# EAGLE design lcd_buckler_mk_2 (EAGLE 6.5.0)
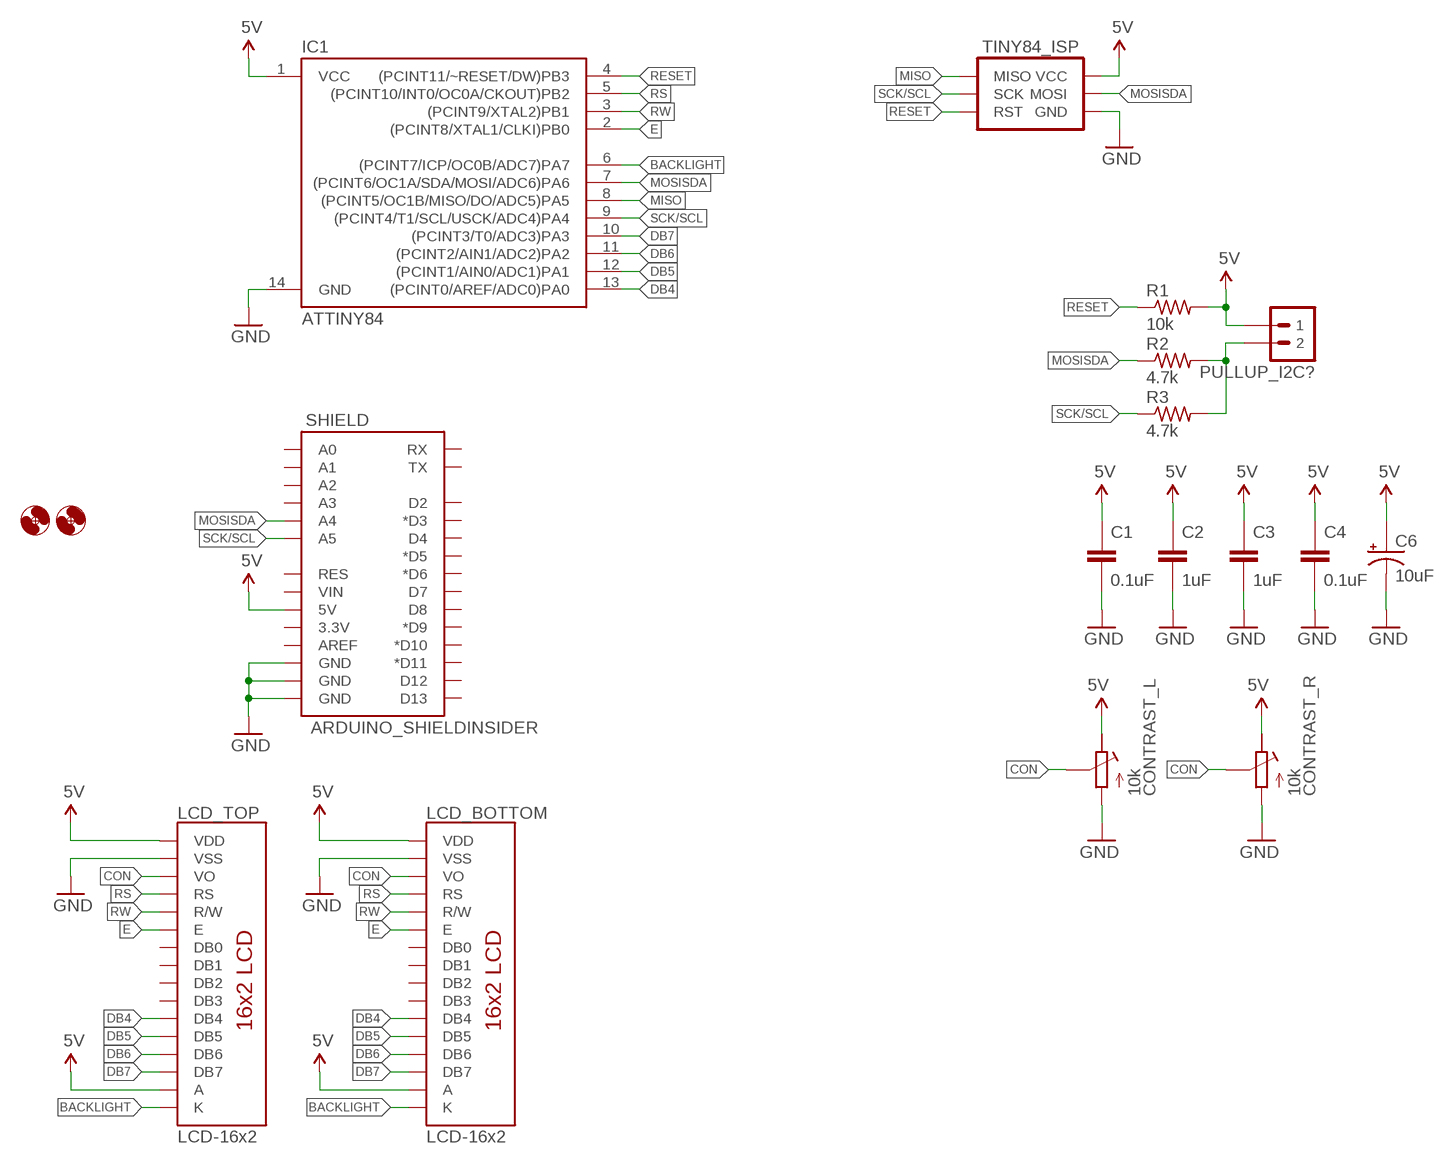
[diagram p0: schematic, sheet 1]

## Parts
C1  0.1uF  CAPACITOR-CERAMICC0805  [C0805]
C2  1uF  CAPACITOR-CERAMIC025-024X044  [C025-024X044]
C3  1uF  CAPACITOR-CERAMIC025-024X044  [C025-024X044]
C4  0.1uF  CAPACITOR-CERAMIC025-024X044  [C025-024X044]
C6  10uF  CAPACITOR-POLARIZEDE2.5-5  [E2,5-5]
CONTRAST_L  10k  POTENTIOMETERTHUMBWHEEL-16MM  [POT-THUMBWHEEL]
CONTRAST_R  10k  POTENTIOMETERTHUMBWHEEL-16MM  [POT-THUMBWHEEL]
H1  HOLE#2  [HOLE-#2]
H2  HOLE#2  [HOLE-#2]
IC1  ATTINY84  [SO14]
LCD_BOTTOM  LCD-16x2  LCD-16X2HOLESONLY  [LCD-16X2-PINS-ONLY]
LCD_TOP  LCD-16x2  LCD-16X2HOLESONLY  [LCD-16X2-PINS-ONLY]
PULLUP_I2C?  M02PTH  [1X02]
R1  10k  RESISTORR0805  [R0805]
R2  4.7k  RESISTORPTH-AXIAL-7.68MM  [RESISTOR-AXIAL-PTH-7.68MM]
R3  4.7k  RESISTORPTH-AXIAL-7.68MM  [RESISTOR-AXIAL-PTH-7.68MM]
SHIELD  ARDUINO_SHIELDINSIDER  [ARDUINO_SHIELD_NOOUTLINE_INSIDE]
TINY84_ISP  AVR_SPI_PRG_6PTH  [2X3]

## Nets
5V: C1.1 C2.1 C3.1 C4.1 C6.+ CONTRAST_L.3(E) CONTRAST_R.3(E) IC1.1(VCC) LCD_BOTTOM.2(VDD) LCD_BOTTOM.15(A) LCD_TOP.2(VDD) LCD_TOP.15(A) PULLUP_I2C?.1 R1.2 SHIELD.5V TINY84_ISP.2(VCC)
BACKLIGHT: IC1.6((PCINT7/ICP/OC0B/ADC7)PA7) LCD_BOTTOM.16(K) LCD_TOP.16(K)
CON: CONTRAST_L.2(S) CONTRAST_L.2@1(S) CONTRAST_R.2(S) CONTRAST_R.2@1(S) LCD_BOTTOM.3(VO) LCD_TOP.3(VO)
DB4: IC1.13((PCINT0/AREF/ADC0)PA0) LCD_BOTTOM.11(DB4) LCD_TOP.11(DB4)
DB5: IC1.12((PCINT1/AIN0/ADC1)PA1) LCD_BOTTOM.12(DB5) LCD_TOP.12(DB5)
DB6: IC1.11((PCINT2/AIN1/ADC2)PA2) LCD_BOTTOM.13(DB6) LCD_TOP.13(DB6)
DB7: IC1.10((PCINT3/T0/ADC3)PA3) LCD_BOTTOM.14(DB7) LCD_TOP.14(DB7)
E: IC1.2((PCINT8/XTAL1/CLKI)PB0) LCD_BOTTOM.6(E) LCD_TOP.6(E)
GND: C1.2 C2.2 C3.2 C4.2 C6.- CONTRAST_L.1(A) CONTRAST_R.1(A) IC1.14(GND) LCD_BOTTOM.1(VSS) LCD_TOP.1(VSS) SHIELD.GND@0(GND) SHIELD.GND@1(GND) SHIELD.GND@2(GND) TINY84_ISP.6(GND)
MISO: IC1.8((PCINT5/OC1B/MISO/DO/ADC5)PA5) TINY84_ISP.1(MISO)
MOSISDA: IC1.7((PCINT6/OC1A/SDA/MOSI/ADC6)PA6) R2.P$1 SHIELD.A4 TINY84_ISP.4(MOSI)
N$1: PULLUP_I2C?.2 R2.P$2 R3.P$2
RESET: IC1.4((PCINT11/~RESET/DW)PB3) R1.1 TINY84_ISP.5(RST)
RS: IC1.5((PCINT10/INT0/OC0A/CKOUT)PB2) LCD_BOTTOM.4(RS) LCD_TOP.4(RS)
RW: IC1.3((PCINT9/XTAL2)PB1) LCD_BOTTOM.5(R/W) LCD_TOP.5(R/W)
SCK/SCL: IC1.9((PCINT4/T1/SCL/USCK/ADC4)PA4) R3.P$1 SHIELD.A5 TINY84_ISP.3(SCK)
Unconnected: LCD_BOTTOM.7(DB0) LCD_BOTTOM.8(DB1) LCD_BOTTOM.9(DB2) LCD_BOTTOM.10(DB3) LCD_TOP.7(DB0) LCD_TOP.8(DB1) LCD_TOP.9(DB2) LCD_TOP.10(DB3) SHIELD.3.3V SHIELD.A0 SHIELD.A1 SHIELD.A2 SHIELD.A3 SHIELD.AREF SHIELD.D2 SHIELD.D3(*D3) SHIELD.D4 SHIELD.D5(*D5) SHIELD.D6(*D6) SHIELD.D7 SHIELD.D8 SHIELD.D9(*D9) SHIELD.D10(*D10) SHIELD.D11(*D11) SHIELD.D12 SHIELD.D13 SHIELD.RES SHIELD.RX SHIELD.TX SHIELD.VIN

## Library data of the parts
C1-C4 = A_butts:CAPACITOR-CERAMIC: CAPACITOR, European symbol
C6 = A_butts:CAPACITOR-POLARIZED: POLARIZED CAPACITOR, American symbol
CONTRAST_L CONTRAST_R = A_butts:POTENTIOMETER: Trimm resistor
H1 H2 = A_butts:HOLE: MOUNTING HOLE with drill center marker
IC1 = A_butts:ATTINY84: Atmel 14-pin 2/4/8kB flash uC
LCD_BOTTOM LCD_TOP = A_butts:LCD-16X2: Standard text-only 16x2 parallel input LCD
PULLUP_I2C? = A_butts:M02: Standard 2-pin 0.1" header. Use with - straight break away headers ( PRT-00116) - right angle break away headers (PRT-00553) - swiss pins (PRT-00743) - machine pins (PRT-00117) - female headers (PRT-00115) Molex polarized connector foot print use with: PRT-08233 with associated crimp pins and housings. 2.54_SCREWTERM for use with PRT-10571. 3.5mm Screw Terminal footprints for PRT-08084 5mm Screw Terminal footprints for use with PRT-08433
R1-R3 = A_butts:RESISTOR: RESISTOR, American symbol
SHIELD = A_butts:ARDUINO_SHIELD: Arduino shield footprint
TINY84_ISP = A_butts:AVR_SPI_PRG_6: AVR ISP 6 Pin This is the reduced ISP connector for AVR programming. Common on Arduino. This footprint will take up less PCB space and can be used with a 10-pin to 6-pin adapter such as SKU: BOB-08508 **Special note about "TEST_POINT" package. The stop mask is on the top side, so if you want your programming test points to be on the bottom of your board, make sure to place this package on the bottom side of the board. This also ensure that the orientation to program from the bottom side will be correct.

## Board
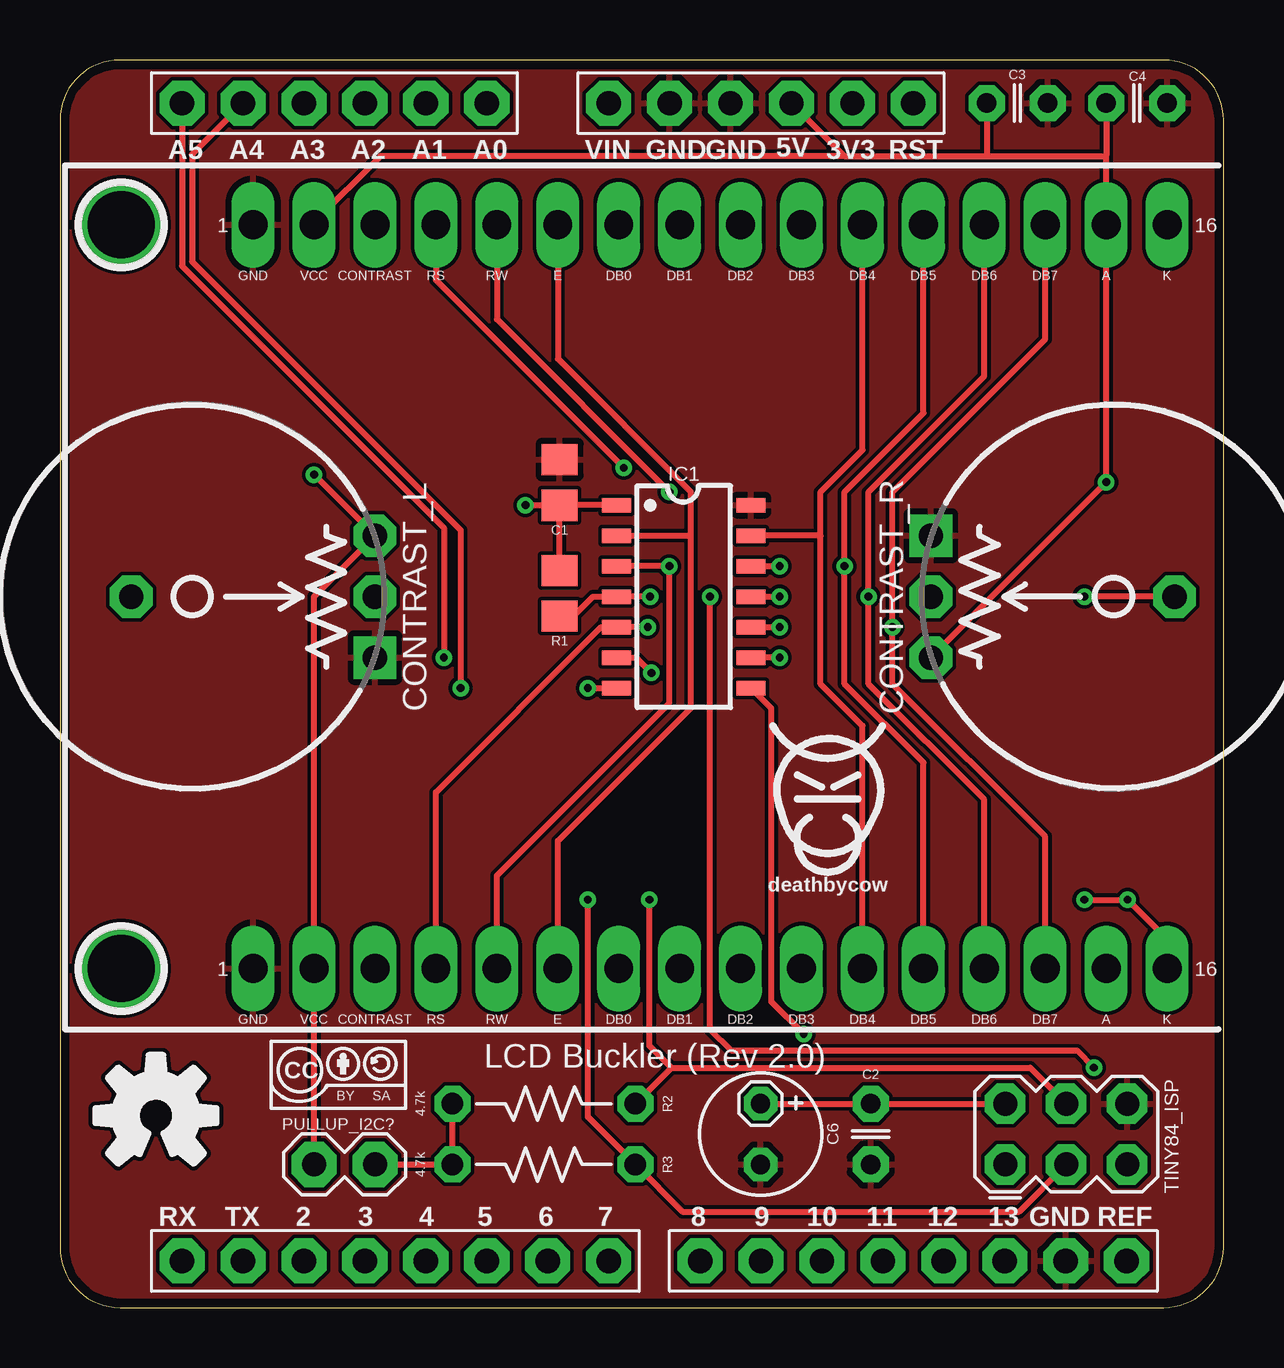
[diagram p1: board, top side]
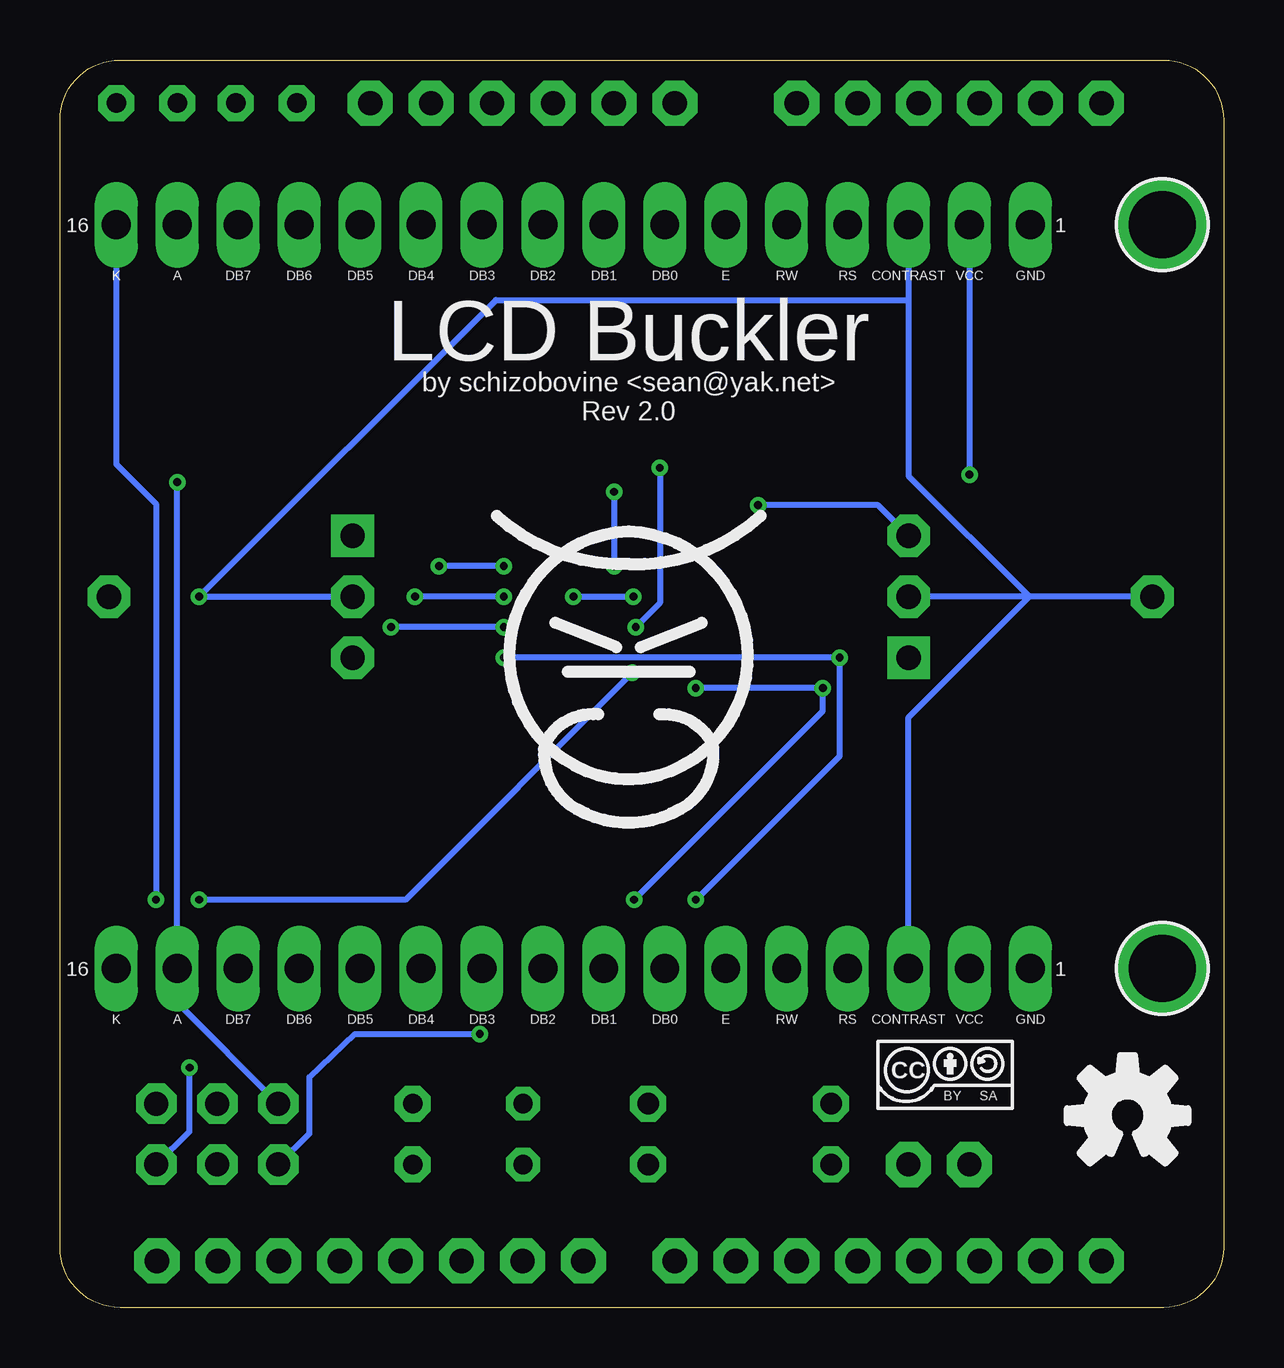
[diagram p2: board, bottom side, seen from below]

Size 48.5 x 52 mm. Coordinates in mm from the lower left corner, seen from the top.
Outline: 48.5,2.5 48.5,49.5 arc90 46,52 2.5,52 arc90 0,49.5 0,2.5 arc90 2.5,0 46,0 arc90 48.5,2.5
Copper layers (1*16): Top 0.0356mm / dielectric 1.5011mm / Bottom 0.0356mm
Design rules "LaenPCBOrder_2": minimum track width 6mil, minimum drill 13mil, track to track 6mil, track to pad 6mil, pad to pad 6mil, via to via 6mil, smd to smd 6mil, copper to edge 15mil, drill to drill 6mil, minimum pad ring 7mil, minimum via ring 7mil, stop-mask expansion 3mil, vias tented up to drill 20mil, thermal gap 10mil

### Footprints (pad centres in the part's own frame; a part is rotated, then mirrored left to right if it is on the bottom)
C0805 = smd 1.3 x 1.5: 1 -0.95,0; 2 0.95,0
C025-024X044 = drill 0.813 pad 1.5 octagon: 1 -1.27,0; 2 1.27,0
E2,5-5 = drill 0.8 pad 1.4 octagon: + -1.27,0; - 1.27,0
POT-THUMBWHEEL = drill 1.016 pad 1.778 square: 1 -2.54,0 | drill 1.016 pad 1.778 octagon: 2 0,0; 2@1 0,10.16; 3 2.54,0
HOLE-#2 = drill 2.8 pad 3.81: P$1 0,0
SO14 = smd 0.6 x 1.2: 1 -3.81,-2.8; 2 -2.54,-2.8; 3 -1.27,-2.8; 4 0,-2.8; 5 1.27,-2.8; 6 2.54,-2.8; 7 3.81,-2.8; 8 3.81,2.8; 9 2.54,2.8; 10 1.27,2.8; 11 0,2.8; 12 -1.27,2.8; 13 -2.54,2.8; 14 -3.81,2.8
LCD-16X2-PINS-ONLY = drill 1.2 pad 1.778 long: 1 0,0; 2 2.54,0; 3 5.08,0; 4 7.62,0; 5 10.16,0; 6 12.7,0; 7 15.24,0; 8 17.78,0; 9 20.32,0; 10 22.86,0; 11 25.4,0; 12 27.94,0; 13 30.48,0; 14 33.02,0; 15 35.56,0; 16 38.1,0
1X02 = drill 1 pad 1.88 octagon: 1 0,0; 2 2.54,0
R0805 = smd 1.3 x 1.5: 1 -0.95,0; 2 0.95,0
RESISTOR-AXIAL-PTH-7.68MM = drill 0.9 pad 1.5 octagon: P$1 -3.81,0; P$2 3.81,0
ARDUINO_SHIELD_NOOUTLINE_INSIDE = drill 1.016 pad 1.88 octagon: 3.3V 48.26,-27.94; 5V 48.26,-25.4; A0 48.26,-12.7; A1 48.26,-10.16; A2 48.26,-7.62; A3 48.26,-5.08; A4 48.26,-2.54; A5 48.26,0; AREF 0,-39.37; D2 0,-5.08; D3 0,-7.62; D4 0,-10.16; D5 0,-12.7; D6 0,-15.24; D7 0,-17.78; D8 0,-21.59; D9 0,-24.13; D10 0,-26.67; D11 0,-29.21; D12 0,-31.75; D13 0,-34.29; GND@0 48.26,-22.86; GND@1 48.26,-20.32; GND@2 0,-36.83; RES 48.26,-30.48; RX 0,0; TX 0,-2.54; VIN 48.26,-17.78
2X3 = drill 1 pad 1.676 octagon: 1 -2.54,-1.27; 2 -2.54,1.27; 3 0,-1.27; 4 0,1.27; 5 2.54,-1.27; 6 2.54,1.27

### Placement (x,y rotation side)
C1  20.83,34.39 90 top
C2  33.8,7.23 270 top
C3  39.9,50.2 0 top
C4  44.88,50.2 0 top
C6  29.2,7.23 270 top
CONTRAST_L  13.13,29.63 90 top
CONTRAST_R  36.3,29.63 270 top
H1  2.55,45.13 270 top
H2  2.55,14.13 270 top
IC1  26,29.63 270 top
LCD_BOTTOM  8.05,14.13 0 top
LCD_TOP  8.05,45.13 0 top
PULLUP_I2C?  10.59,5.96 0 top
R1  20.83,29.77 90 top
R2  20.17,8.5 180 top
R3  20.17,5.96 180 top
SHIELD  5.09,1.94 90 top
TINY84_ISP  41.94,7.23 0 top
U$1  [COW]  24.8,26 0 bottom
U$2  [COW_SMALL]  32,21.7 0 top
U$3  [CC-BY-SA-4.0-NO-URL]  11.6,9.7 0 top
U$4  [CC-BY-SA-4.0-NO-URL]  11.6,9.7 0 bottom
U$5  [OSHWLOGO_TOP_0.2_A]  4,8 0 top
U$6  [OSHWLOGO_BOT_0.2_A]  4,8 0 top

### Tracks (layer width: path | path; a pad name or v marks a point on that pad's centre or on a via)
5V  (via drill 0.33)
  Top 0.25: SHIELD.5V 32.69,48 | 32.69,48 38.63,48 | 38.63,48 43.6,48 | C3.1 38.63,48 | C4.1 43.61,48.01 43.6,48 | 43.6,48 43.61,47.99 LCD_TOP.15 v43.61,34.4 CONTRAST_R.3 | 32.69,48 13.36,48 10.59,45.23 LCD_TOP.2 | v10.59,34.71 CONTRAST_L.3 10.59,29.63 LCD_BOTTOM.2 PULLUP_I2C?.1 | C6.+ C2.1 TINY84_ISP.2 | IC1.1 C1.1 | R1.2 C1.1 | v19.4,33.44 C1.1
  Bottom 0.25: LCD_TOP.2 v10.59,34.71 | TINY84_ISP.2 43.61,12.71 LCD_BOTTOM.15 v43.61,34.4 | CONTRAST_L.3 14.4,33.44 v19.4,33.44
BACKLIGHT  (via drill 0.33)
  Top 0.25: IC1.6 24.01,27.09 v24.65,26.45 | v42.7,17 v44.5,17 46.15,15.35 LCD_BOTTOM.16
  Bottom 0.25: v24.65,26.45 34.1,17 v42.7,17 | LCD_TOP.16 46.15,35.15 44.5,33.5 v44.5,17
CON  (via drill 0.33)
  Top 0.25: CONTRAST_R.2@1 v42.7,29.63
  Bottom 0.25: CONTRAST_L.2@1 8.1,29.63 | 8.1,29.63 CONTRAST_L.2 | CONTRAST_R.2 v42.7,29.63 30.33,42 13.13,42 | LCD_BOTTOM.3 13.13,24.6 8.1,29.63 | LCD_TOP.3 13.13,42 | 13.13,42 13.13,34.66 8.1,29.63
DB4
  Top 0.25: LCD_BOTTOM.11 33.45,24.25 31.7,26 31.7,32.17 | LCD_TOP.11 33.45,35.75 31.7,34 31.7,32.17 | 31.7,32.17 IC1.13
DB5  (via drill 0.33)
  Top 0.25: LCD_BOTTOM.12 35.99,22.71 32.7,26 v32.7,30.9 32.7,34 35.99,37.29 LCD_TOP.12 | IC1.12 v30,30.9
  Bottom 0.25: v30,30.9 v32.7,30.9
DB6  (via drill 0.33)
  Top 0.25: LCD_BOTTOM.13 38.53,21.17 33.7,26 v33.7,29.63 33.7,34 38.53,38.83 LCD_TOP.13 | IC1.11 v30,29.63
  Bottom 0.25: v30,29.63 v33.7,29.63
DB7  (via drill 0.33)
  Top 0.25: LCD_BOTTOM.14 41.07,19.63 34.7,26 v34.7,28.36 34.7,34 41.07,40.37 LCD_TOP.14 | IC1.10 v30,28.36
  Bottom 0.25: v30,28.36 v34.7,28.36
E
  Top 0.25: LCD_TOP.6 20.75,39.55 26.3,34 26.3,32.2 | LCD_BOTTOM.6 20.75,19.45 26.3,25 26.3,32.2 | IC1.2 26.27,32.17 26.3,32.2
GND
  pour Top: 2.5,52 46,52 arc-90 48.5,49.5 48.5,2.5 arc-90 46,0 2.5,0 arc-90 0,2.5 0,49.5 arc-90
MISO  (via drill 0.33)
  Top 0.25: v31,11.4 29.65,12.75 29.65,24.97 IC1.8
  Bottom 0.25: TINY84_ISP.1 38.1,7.26 38.1,9.6 36.2,11.4 v31,11.4
MOSISDA  (via drill 0.33)
  Top 0.25: SHIELD.A4 5.5,48.07 5.5,43.6 16.7,32.4 v16.7,25.82 | R2.P$1 25.48,10 | 25.48,10 40.44,10 TINY84_ISP.4 | v22,25.82 IC1.7 | 25.48,10 24.57,10.91 v24.57,17
  Bottom 0.25: v22,25.82 v16.7,25.82 16.7,24.87 v24.57,17
N$1
  Top 0.25: PULLUP_I2C?.2 R3.P$2 R2.P$2
RESET  (via drill 0.33)
  Top 0.25: R1.1 21.4,28.82 22.21,29.63 IC1.4 v24.6,29.63 | v43.1,10 42.4,10.7 28,10.7 27.1,11.6 v27.1,29.63
  Bottom 0.25: TINY84_ISP.5 43.1,7.34 v43.1,10 | v27.1,29.63 v24.6,29.63
RS  (via drill 0.33)
  Top 0.25: LCD_TOP.4 15.67,42.83 v23.5,35 | v24.5,28.36 IC1.5 22.56,28.36 15.67,21.47 LCD_BOTTOM.4
  Bottom 0.25: v23.5,35 23.5,29.36 v24.5,28.36
RW  (via drill 0.33)
  Top 0.25: LCD_TOP.5 18.21,41.19 v25.4,34 | IC1.3 v25.4,30.9 25.4,25.2 18.21,18.01 LCD_BOTTOM.5
  Bottom 0.25: v25.4,34 v25.4,30.9
SCK/SCL  (via drill 0.33)
  Top 0.25: SHIELD.A5 5.09,43.41 16,32.5 v16,27.09 | TINY84_ISP.3 39.98,4 25.94,4 R3.P$1 22,7.94 v22,17 | v30,27.09 IC1.9
  Bottom 0.25: v30,27.09 v16,27.09 16,23 v22,17

### Text on the board
tPlace: LCD Buckler (Rev 2.0)
bPlace: LCD Buckler | by schizobovine <sean@yak.net> / Rev 2.0